# Altium schematic sheet Snippet_FT232RL.SchDoc
size 594 x 420 mm
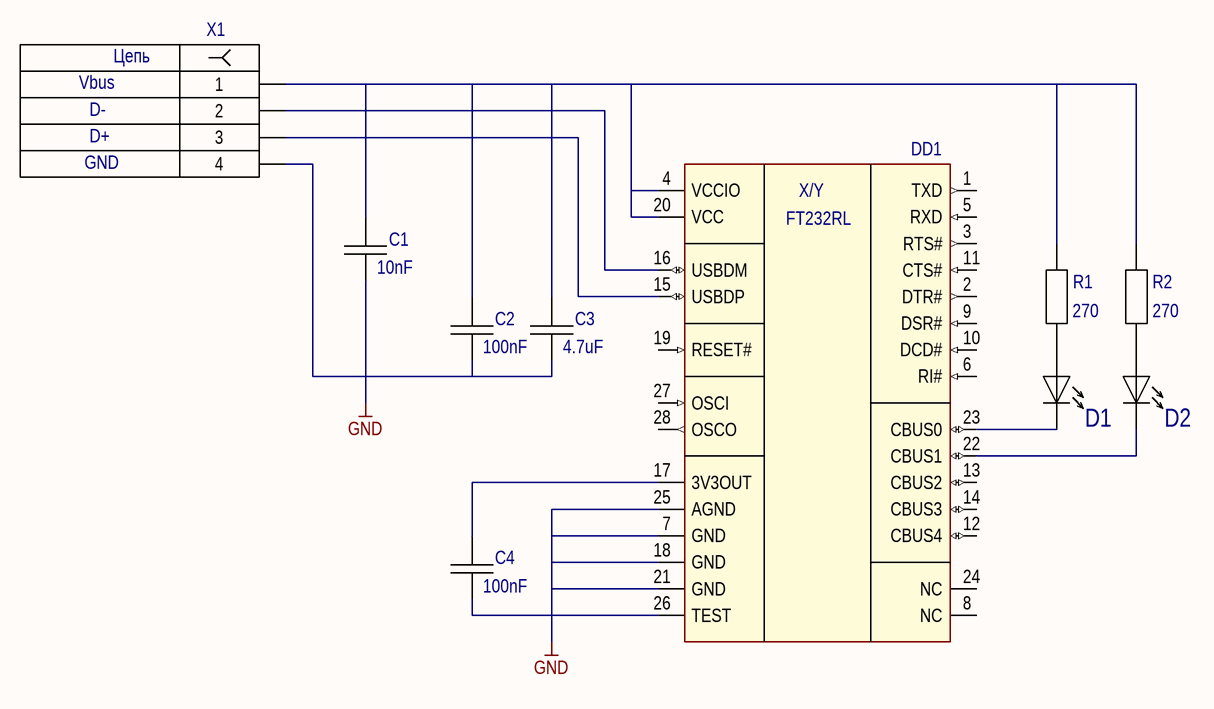
[diagram p0: Snippet_FT232RL.SchDoc]

## Parts
C1  10nF  [Capacitor_0805]
C2  100nF  [Capacitor_0805]
C3  4.7uF  [Capacitor_0805]
C4  100nF  [Capacitor_0805]
D1  LED_2.54mm_R  [LED_2.54mm_R]  (value not drawn)
D2  LED_2.54mm_G  [LED_2.54mm_G]  (value not drawn)
DD1  FT232RL  [FT232RL]  (value not drawn)
R1  270  [RESISTOR_SMD0805]
R2  270  [RESISTOR_SMD0805]
X1  Connector_USB_typeB  [Connector_USB_B]  (value not drawn)

## Nets
GND: C1.2 C2.2 C3.2 C4.2 DD1.7(GND) DD1.18(GND) DD1.21(GND) DD1.25(AGND) DD1.26(TEST) X1.4
NetC1_1: C1.1 C2.1 C3.1 DD1.4(VCCIO) DD1.20(VCC) R1.2 R2.2 X1.1
NetC4_1: C4.1 DD1.17(3V3OUT)
NetD1_1: D1.1 DD1.23(CBUS0)
NetD1_2: D1.2 R1.1
NetD2_1: D2.1 DD1.22(CBUS1)
NetD2_2: D2.2 R2.1
NetDD1_15: DD1.15(USBDP) X1.3
NetDD1_16: DD1.16(USBDM) X1.2

Not connected (* = marked no-connect by the designer): DD1 1(TXD) 2(DTR#) 3(RTS#) 5(RXD) 6(RI#) 8(NC) 9(DSR#) 10(DCD#) 11(CTS#) 12(CBUS4) 13(CBUS2) 14(CBUS3) 19(RESET#) 24(NC) 27(OSCI) 28(OSCO)

## Notes on the sheet
- (in symbol Connector_USB_typeB) Цепь; Vbus; D-; D+; GND
- (in symbol FT232RL) X/Y

## Library data of the parts
C1-C4 = Capacitor
R1 R2 = Resistor_0805